# Altium schematic sheet 485.SchDoc
size 420 x 297 mm; PageSetup: Record=PageOptions|CenterHorizontal=True|CenterVertical=True|PrintScale=0.94|XCorrection=1.00|YCorrection=1.00|PrintKind=1|BorderSize=5000000|LeftOffset=0|BottomOffset=0|Orientation=1|PaperLength=1000|PaperWidth=1000|Scale=100|PaperSource=7|PrintQuality=-4|MediaType=1|DitherType=10|PaperKind=A4|PrintScaleMode=1; DecimalNumber: Децимальный номер; HeadOfSector: Нач. сектора; MainDevice: Перв.примен.; Name: Наименование
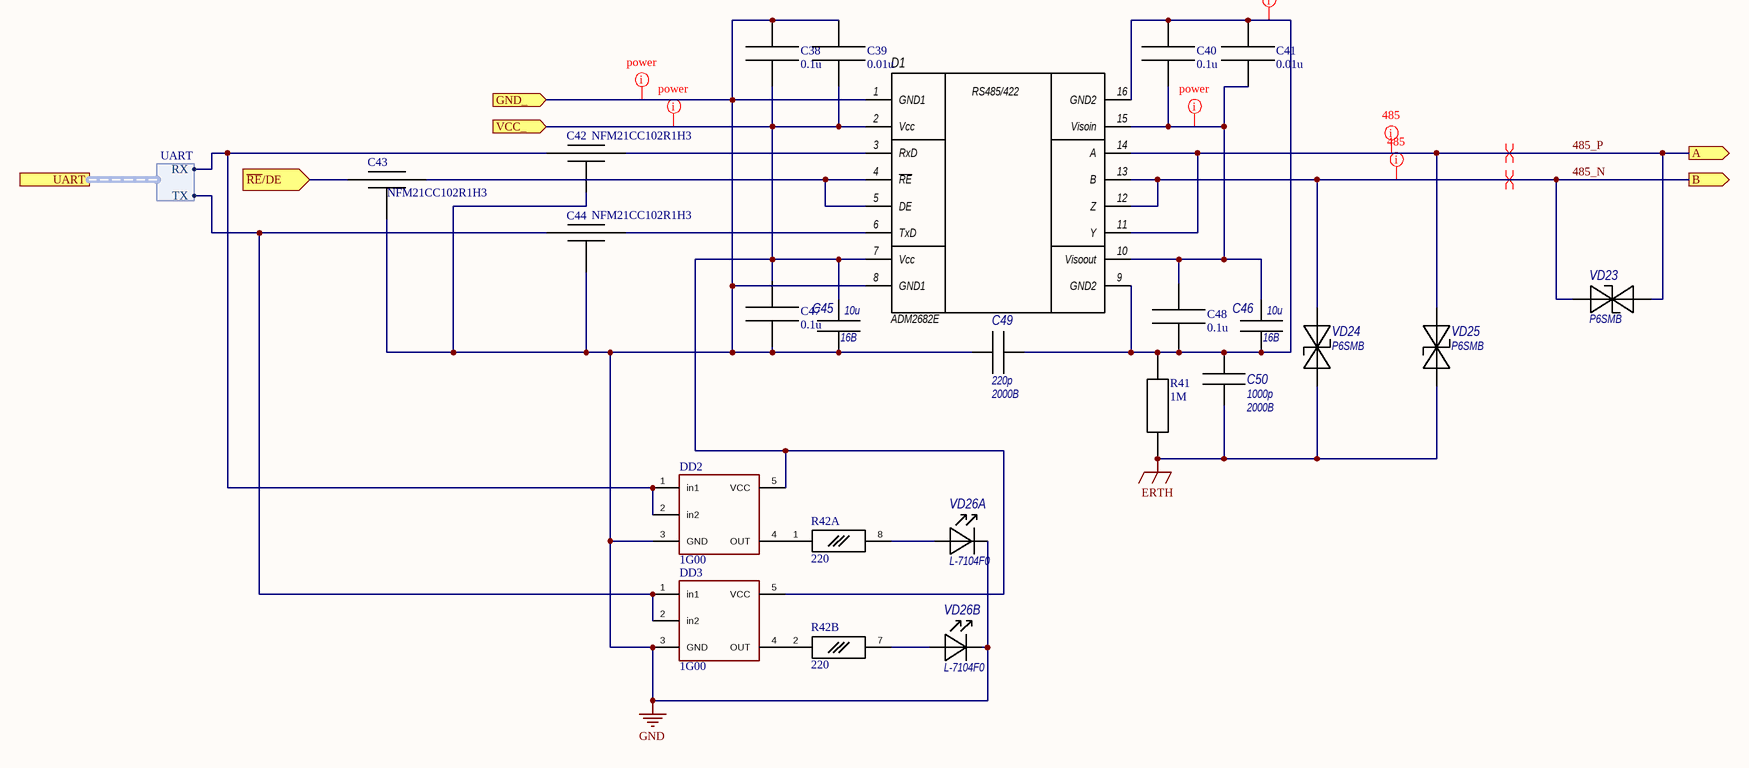
[diagram p0: 485.SchDoc]

## Parts
C38  0.1u  [cap_0402]
C39  0.01u  [cap_0402]
C40  0.1u  [cap_0402]
C41  0.01u  [cap_0402]
C42  NFM21CC102R1H3  [NFM21C]
C43  NFM21CC102R1H3  [NFM21C]
C44  NFM21CC102R1H3  [NFM21C]
C45  value 10u  Voltage: 16В  [C0805_]  (hidden comment: 10u 16v)
C46  value 10u  Voltage: 16В  [C0805_]  (hidden comment: 10u 16v)
C47  0.1u  [cap_0402]
C48  0.1u  [cap_0402]
C49  value 220p  Voltage: 2000В  [C1206_]  (hidden comment: 220p 2000v)
C50  value 1000p  Voltage: 2000В  [C1206_]  (hidden comment: 1000p 2000v)
D1  Type: ADM2682E  [SOIC_16IC_]  (hidden comment: ADM2682E_RS485_422_Isol)
DD2  1G00  [sot-23-5]
DD3  1G00  [sot-23-5]
R41  1M  [0805-res]
R42  220  [YC164]  (parts A,B of 4)
VD23  Type: P6SMB  [SOD-123]  (hidden comment: PTVS33VS1UTR)
VD24  Type: P6SMB  [SOD-123]  (hidden comment: PTVS33VS1UTR)
VD25  Type: P6SMB  [SOD-123]  (hidden comment: PTVS33VS1UTR)
VD26  Type: L-7104F0  [L-7104_]  (hidden comment: Diod_sv_L-7104F0)  (parts A,B of 2)

## Ports
A (out), B (out), GND_ (in), UART (harness UART), VCC_ (in), ~{RE}/DE (in)

## Harnesses
UART: RX, TX

## Nets
ERTH: C50.1 R41.1 VD24.A VD25.A
GND: C38.2 C39.1 C42.3(Gnd) C43.3(Gnd) C44.3(Gnd) C45.1 C47.1 C49.1 D1.1(GND1) D1.8(GND1) DD2.3(GND) DD3.3(GND) VD26.2(K1) VD26.4(K2) ; port GND_
485_N: D1.12(Z) D1.13(B) VD23.K VD24.K ; port B
485_P: D1.11(Y) D1.14(A) VD23.A VD25.K ; port A
~{RE}/DE: C43.1(in) ; port ~{RE}/DE
VCC_: C38.1 C39.2 C45.2 C47.2 D1.2(Vcc) D1.7(Vcc) DD2.5(VCC) DD3.5(VCC) ; port VCC_
NetC40_1: C40.1 C41.2 C46.2 C48.2 D1.10(Visoout) D1.15(Visoin)
NetC40_2: C40.2 C41.1 C46.1 C48.1 C49.2 C50.2 D1.9(GND2) D1.16(GND2) R41.2
NetC42_1: C42.1(in) DD2.1(in1) DD2.2(in2) ; port UART.RX
NetC42_2: C42.2(out) D1.3(RxD)
NetC43_2: C43.2(out) D1.4(~{RE}) D1.5(DE)
NetC44_1: C44.1(in) DD3.1(in1) DD3.2(in2) ; port UART.TX
NetC44_2: C44.2(out) D1.6(TxD)
NetDD2_4: DD2.4(OUT) R42.1
NetDD3_4: DD3.4(OUT) R42.2
NetR42_7: R42.7 VD26.3(A2)
NetR42_8: R42.8 VD26.1(A1)

## Layout directives
net class power: GND, NetC40_1, NetC40_2
rule Width Constraint [Pref Width = 0.3mm    Min Width = 0.3mm    Max Width = 5mm]; net class power: VCC_
net class 485: 485_N, 485_P
differential pair: 485_N, 485_P

## Notes on the sheet
- Подп. и дата
- Инв.№ дубл.
- Взам.инв.№
- Подп.и дата
- Инв.№ подл.
- Изм.
- Лист
- № докум.
- Подп.
- Дата
- Формат  A3
- (in symbol ADM2682E_RS485_422_Isol) RS485/422

## Library data of the parts
C38-C41 C47 C48 = cap
C42-C44 = NFM21C
C45 C46 = Capacitor ceramic: Capacitance: 10u x 16В; Dielectric: *; Tolerance: *
C49 = Capacitor ceramic: Capacitance: 220p x 2000В; Dielectric: *; Tolerance: *
C50 = Capacitor ceramic: Capacitance: 1000p x 2000В; Dielectric: *; Tolerance: *
DD2 DD3 = 1G00: 2NAND
R41 = res
R42 = res_array: YC164
VD23-VD25 = PTVS33VS1UTR: PTVS33VS1UTR,115, TVS DIODE 33VWM 53.3VC SOD123W